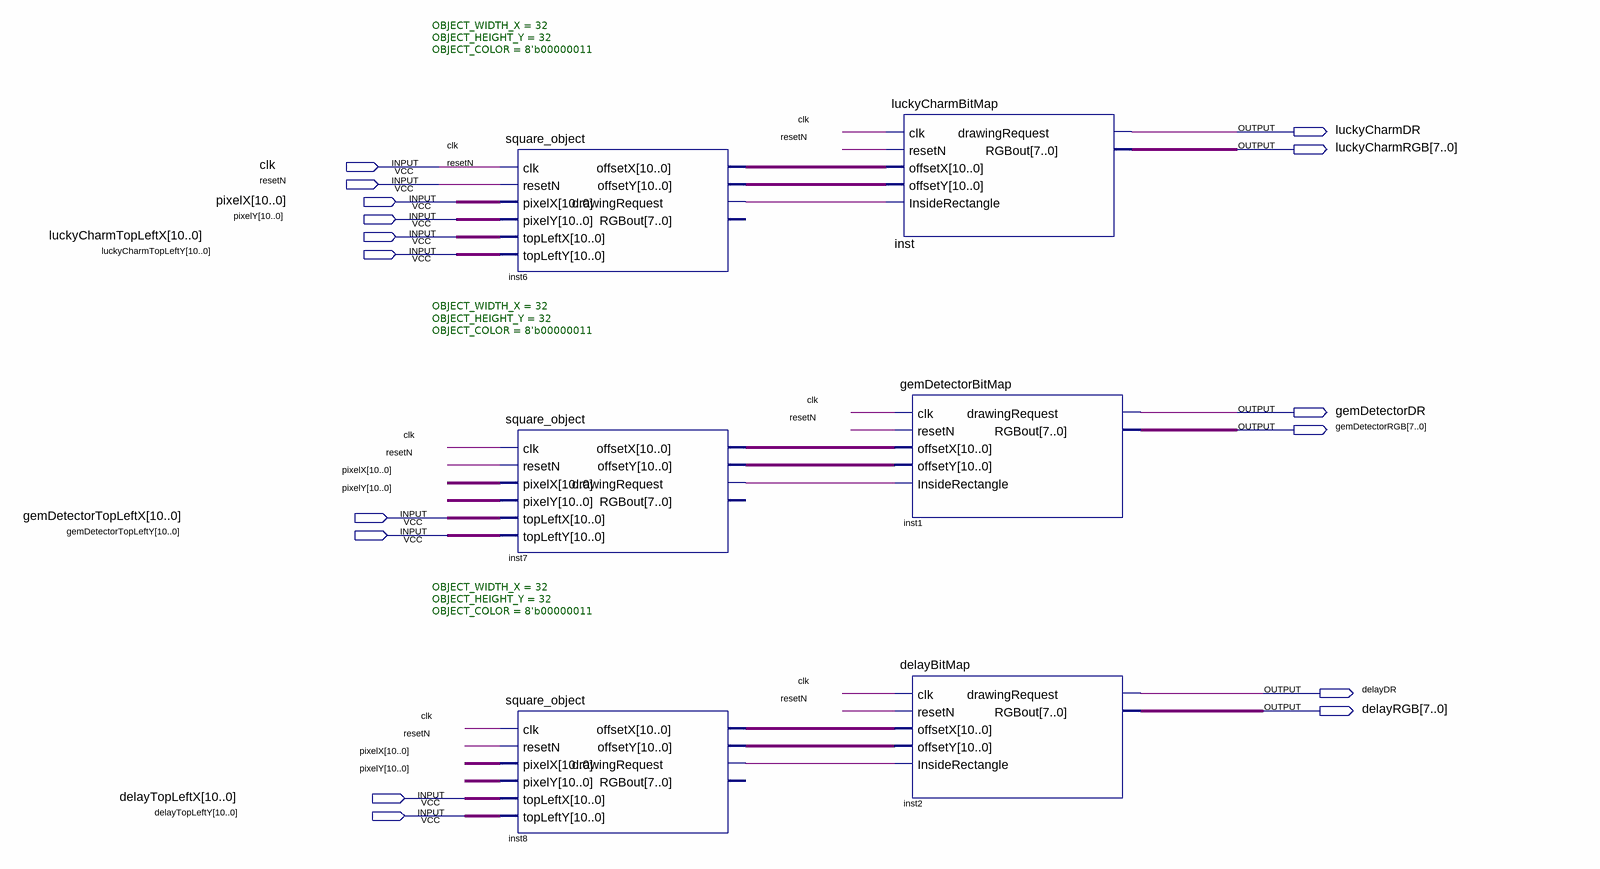
[diagram p0: schematic sheet]
// Quartus schematic Purchase_Block.bdf as structural Verilog: 6 symbols, 16 pins
module Purchase_Block (
  input  clk,
  input  resetN,
  input  [10:0] pixelX,
  input  [10:0] pixelY,
  input  [10:0] luckyCharmTopLeftX,
  input  [10:0] luckyCharmTopLeftY,
  input  [10:0] gemDetectorTopLeftX,
  input  [10:0] gemDetectorTopLeftY,
  input  [10:0] delayTopLeftX,
  input  [10:0] delayTopLeftY,
  output luckyCharmDR,
  output [7:0] luckyCharmRGB,
  output gemDetectorDR,
  output [7:0] gemDetectorRGB,
  output delayDR,
  output [7:0] delayRGB
);

  wire inst6_drawingrequest, inst7_drawingrequest, inst8_drawingrequest;
  wire [10:0] inst6_offsetx, inst6_offsety, inst7_offsetx, inst7_offsety, inst8_offsetx, inst8_offsety;

  square_object #(.OBJECT_WIDTH_X(32), .OBJECT_HEIGHT_Y(32), .OBJECT_COLOR(8'b00000011)) inst6 (
    .clk(clk), .resetN(resetN), .pixelX(pixelX), .pixelY(pixelY), .topLeftX(luckyCharmTopLeftX),
    .topLeftY(luckyCharmTopLeftY), .offsetX(inst6_offsetx), .offsetY(inst6_offsety),
    .drawingRequest(inst6_drawingrequest));  // open: RGBout
  square_object #(.OBJECT_WIDTH_X(32), .OBJECT_HEIGHT_Y(32), .OBJECT_COLOR(8'b00000011)) inst7 (
    .clk(clk), .resetN(resetN), .pixelX(pixelX), .pixelY(pixelY), .topLeftX(gemDetectorTopLeftX),
    .topLeftY(gemDetectorTopLeftY), .offsetX(inst7_offsetx), .offsetY(inst7_offsety),
    .drawingRequest(inst7_drawingrequest));  // open: RGBout
  square_object #(.OBJECT_WIDTH_X(32), .OBJECT_HEIGHT_Y(32), .OBJECT_COLOR(8'b00000011)) inst8 (
    .clk(clk), .resetN(resetN), .pixelX(pixelX), .pixelY(pixelY), .topLeftX(delayTopLeftX),
    .topLeftY(delayTopLeftY), .offsetX(inst8_offsetx), .offsetY(inst8_offsety),
    .drawingRequest(inst8_drawingrequest));  // open: RGBout
  luckyCharmBitMap inst (
    .clk(clk), .resetN(resetN), .offsetX(inst6_offsetx), .offsetY(inst6_offsety),
    .InsideRectangle(inst6_drawingrequest), .drawingRequest(luckyCharmDR), .RGBout(luckyCharmRGB));
  gemDetectorBitMap inst1 (
    .clk(clk), .resetN(resetN), .offsetX(inst7_offsetx), .offsetY(inst7_offsety),
    .InsideRectangle(inst7_drawingrequest), .drawingRequest(gemDetectorDR), .RGBout(gemDetectorRGB));
  delayBitMap inst2 (
    .clk(clk), .resetN(resetN), .offsetX(inst8_offsetx), .offsetY(inst8_offsety),
    .InsideRectangle(inst8_drawingrequest), .drawingRequest(delayDR), .RGBout(delayRGB));
endmodule
